# EasyEDA Pro project DRV8701E双电机驱动（逐飞布局）jzk.eprj

# Schematic DRV8701ERGER电机驱动双路
Board Name: DRV8701ERGER电机驱动双路（已验证）; Create Date: 2025-02-07; Page Name: P2; Project Name: DRV8701E双电机驱动（逐飞布局）; Schematic Name: DRV8701ERGER电机驱动双路; Update Date: 2025-02-07; Company: 嘉立创EDA; Drawed: 张志高; Page Size: B; Version: V1.0
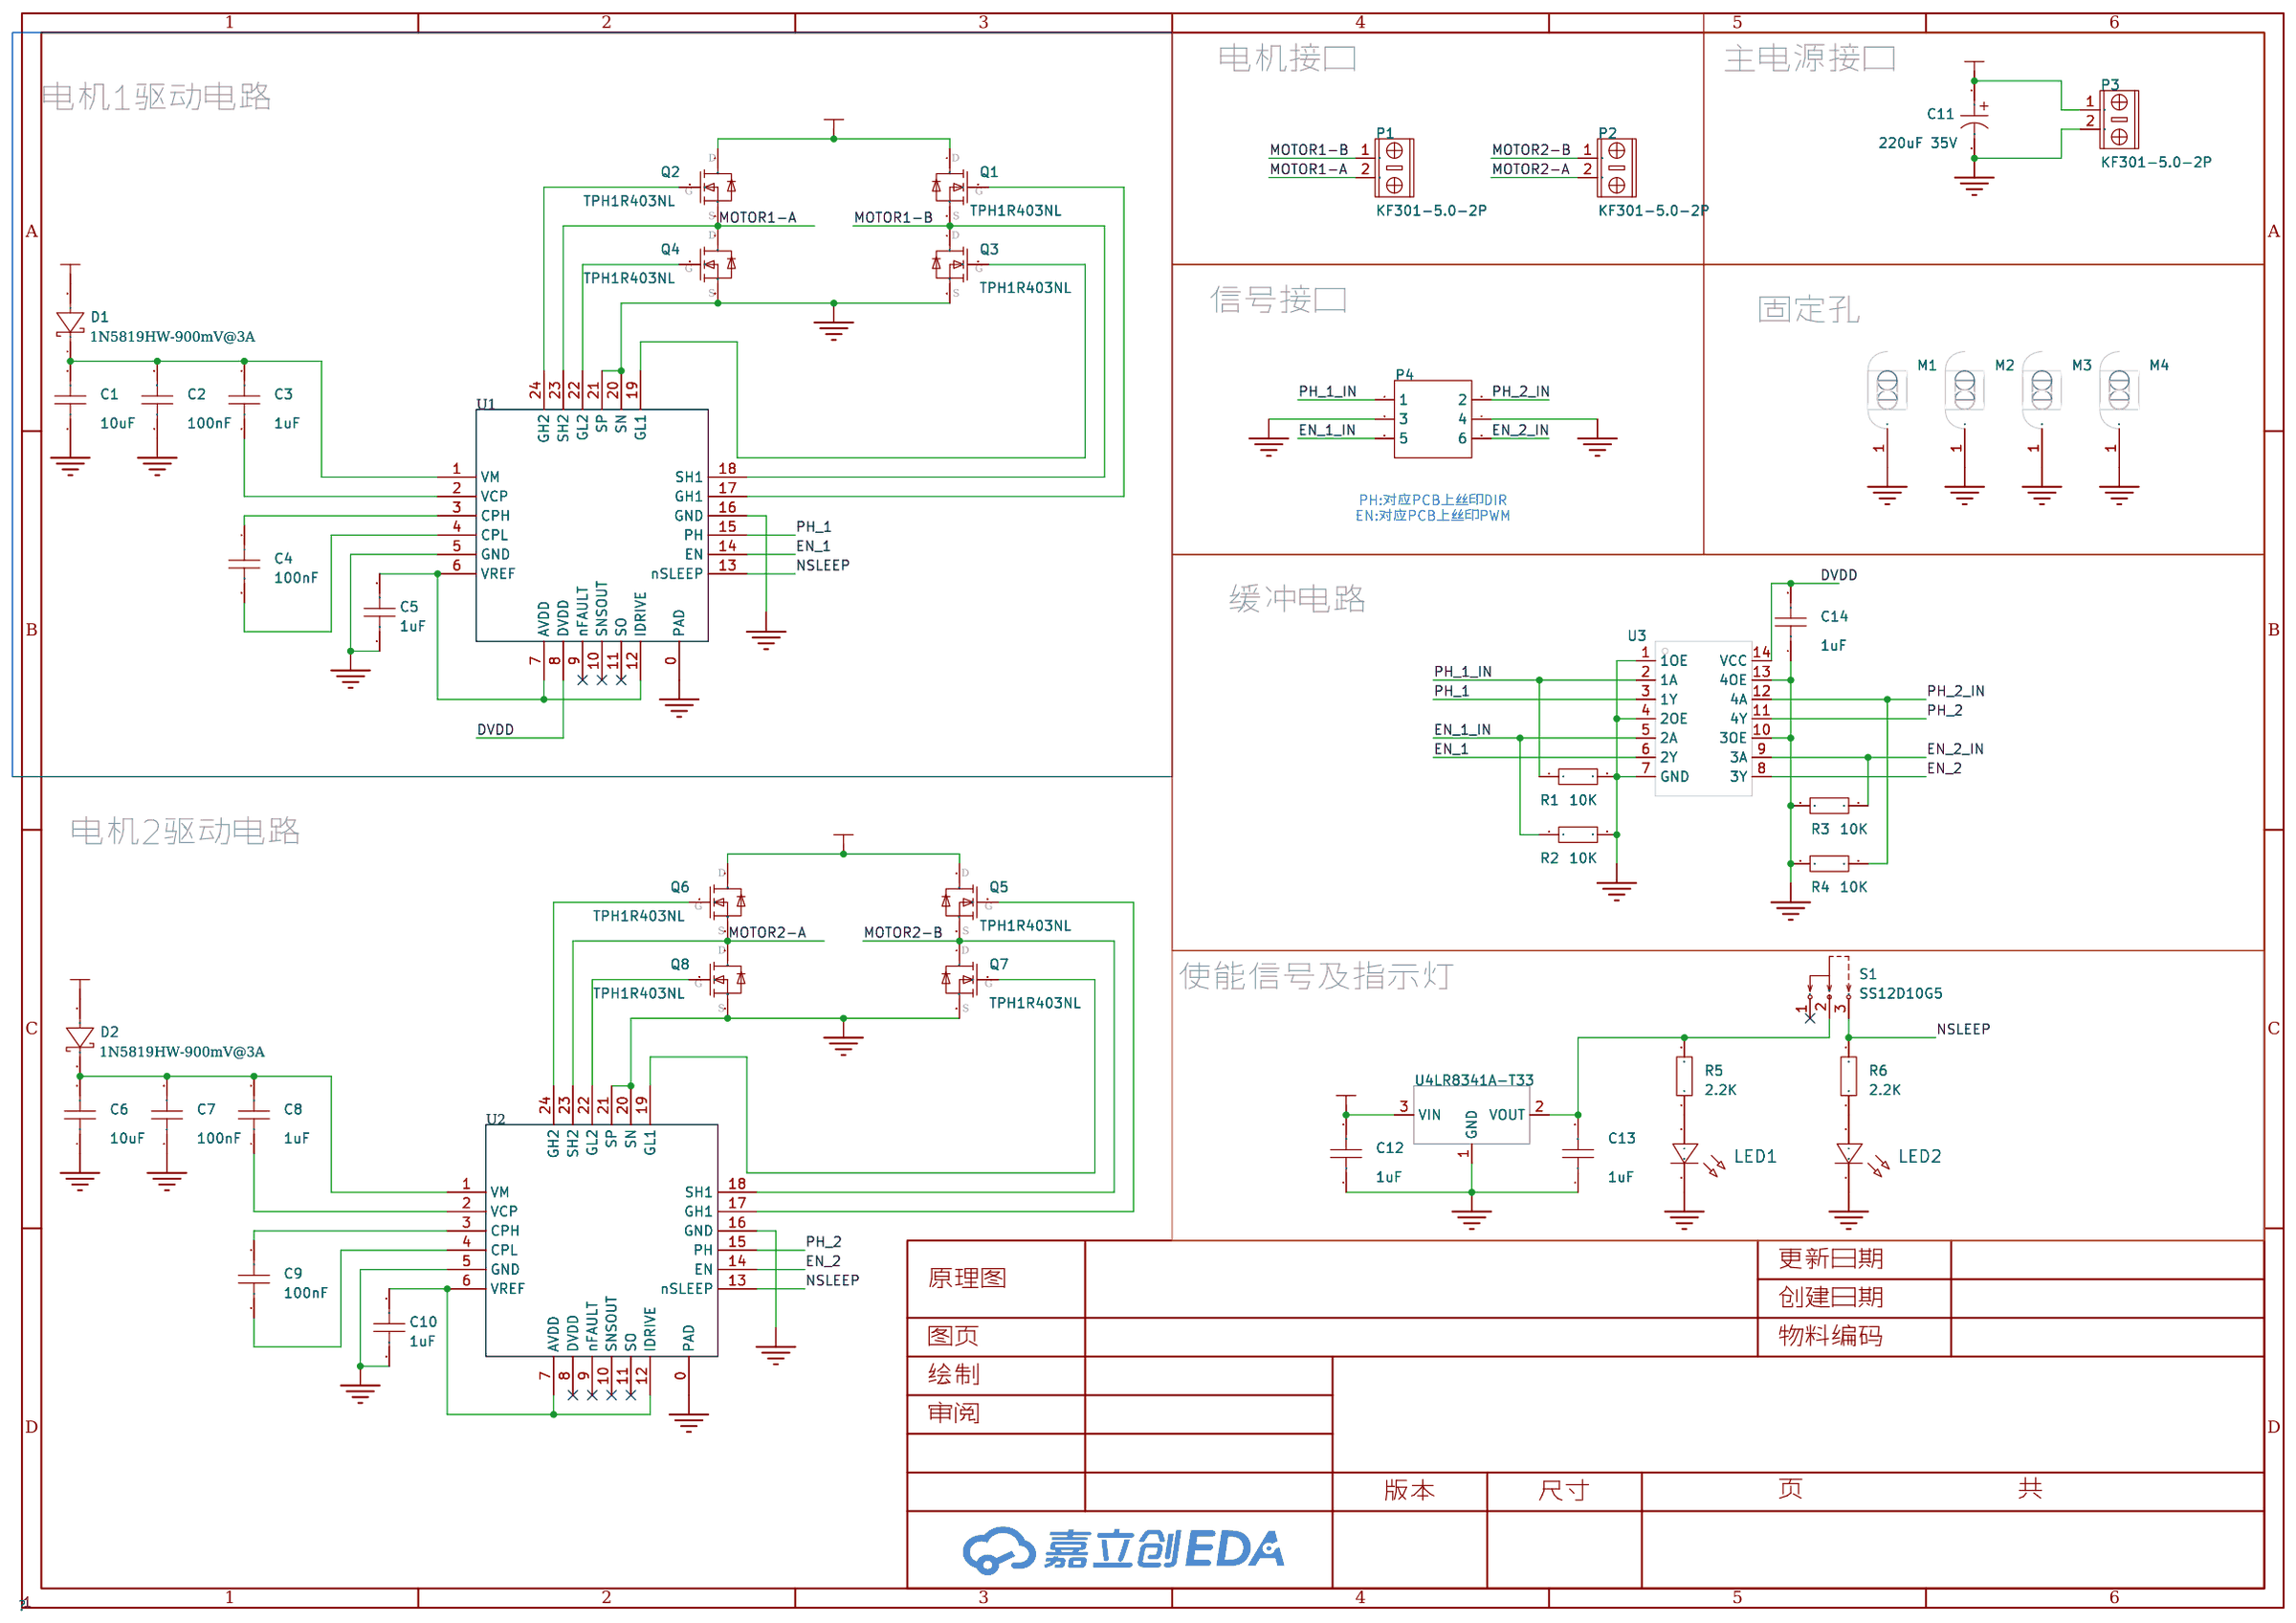
[diagram p0: schematic sheet]

## Parts
C1  10uF  [C0805]
C2  100nF  [C0603]
C3  1uF  [C0603]
C4  100nF  [C0603]
C5  1uF  [C0603]
C6  10uF  [C0805]
C7  100nF  [C0603]
C8  1uF  [C0603]
C9  100nF  [C0603]
C10  1uF  [C0603]
C11  220uF 35V  [CAP-TH_BD8.0-P3.50-D0.6-FD-2]
C12  1uF  [C0603]
C13  1uF  [C0603]
C14  1uF  [C0603]
D1  1N5819HW-900mV@3A  [SOD-123_L2.7-W1.6-LS3.7-RD-1]
D2  1N5819HW-900mV@3A  [SOD-123_L2.7-W1.6-LS3.7-RD-1]
LED1  -  [LED_0805]
LED2  -  [LED_0805]
M1  -  [长圆形固定孔L5.0-O3.0]
M2  -  [长圆形固定孔L5.0-O3.0]
M3  -  [长圆形固定孔L5.0-O3.0]
M4  -  [长圆形固定孔L5.0-O3.0]
P1  KF301-5.0-2P  [CONN-TH_P5.00_KF301-5.0-2P]
P2  KF301-5.0-2P  [CONN-TH_P5.00_KF301-5.0-2P]
P3  KF301-5.0-2P  [CONN-TH_P5.00_KF301-5.0-2P]
P4  -  [HDR-TH_6P-P2.54-V-F-R2-C3-S2.54]
Q1  TPH1R403NL  [DFN5x6]
Q2  TPH1R403NL  [DFN5x6]
Q3  TPH1R403NL  [DFN5x6]
Q4  TPH1R403NL  [DFN5x6]
Q5  TPH1R403NL  [DFN5x6]
Q6  TPH1R403NL  [DFN5x6]
Q7  TPH1R403NL  [DFN5x6]
Q8  TPH1R403NL  [DFN5x6]
R1  10K  [R0603]
R2  10K  [R0603]
R3  10K  [R0603]
R4  10K  [R0603]
R5  2.2K  [R0603]
R6  2.2K  [R0603]
S1  SS12D10G5  [SW-TH_SHOU-HAN_SS12D10G4]
U1  -  [VQFN-24_L4.0-W4.0-P0.50-TL-EP2.8]
U2  -  [VQFN-24_L4.0-W4.0-P0.50-TL-EP2.8]
U3  SN74HC125PWR  [TSSOP-14_L5.0-W4.4-P0.65-LS6.5-BL]
U4  LR8341A-T33  [SOT-23-3L_L2.9-W1.6-P1.90-LS2.8-BL]

## Library data of the parts
C1 C6 = CAP_0805: Supplier Footprint: 0805
C2-C5 C7-C10 C12-C14 = CAP_0603: Supplier Footprint: 0603
C11 = KNH2220UF35V149EC0049: 容值:220uF;精度:±20%;额定电压:35V;纹波电流:1.7A@100kHz;等效串联电阻:40mΩ@100kHz;; LCSC Part Name: 220uF ±20% 35V; Supplier Part: C2981462; Manufacturer: KNSCHA(科尼盛); Supplier Footprint: 插件,D8xL9mm; JLCPCB Part Class: 扩展库; Datasheet: https://atta.szlcsc.com/upload/public/pdf/source/20220426/9FC8A158D93B909CC105160B4A0CB698.pdf; Supplier: LCSC; Tolerance: ±20%; Rated Voltage: 35V; Ripple Current: 1.7A@100kHz; Equivalent Series Resistance(ESR): 40mΩ@100kHz; Lead Spacing: 3.5mm; φD: 8mm; L: 9mm; Lifetime @ Temp: 2000hrs@105℃; Operating Temperature: -55℃~+105℃
D1 D2 = 1N5819W: 二极管配置:-;正向压降(Vf):900mV@3A;直流反向耐压(Vr):40V;平均整流电流(Io):1A;; LCSC Part Name: 电压:40V 电流:1A; Supplier Part: C2905650; Manufacturer: TECH PUBLIC(台舟); Supplier Footprint: SOD-123; JLCPCB Part Class: 扩展库; Datasheet: https://atta.szlcsc.com/upload/public/pdf/source/20211020/7FEA34DA99E5285CBA3CC87767B82BE7.pdf; Supplier: LCSC; Forward Voltage (Vf@If): 900mV@3A; Reverse Voltage (Vr): 40V; Average Rectified Current (Io): 1A; Reverse Leakage Current (Ir): 1mA@40V
LED1 LED2 = LED_0805-R: Supplier Footprint: 0805
M1-M4 = 长圆形固定孔L5.0-O3.0
P1-P3 = KF301-5.0-2P: 结构:1x2P;间距:5mm;颜色:蓝色;安装方式:直插;额定电流:17A;额定电压:250V;排数:1;线规 - AWG:14~22;线规 - 平方毫米:1.5;每排PIN数:2;工作温度范围:-30℃~+120℃;; Supplier: LCSC; Supplier Part: C474881; Manufacturer: KEFA(科发); JLCPCB Part Class: 扩展库; LCSC Part Name: 5mm 1x2P 排数:1 每排P数:2 直插; Supplier Footprint: 插件,P=5mm; Datasheet: https://atta.szlcsc.com/upload/public/pdf/source/20230317/03A5B5FC229D6F9225E8F51DA1A4E80A.pdf; Structure: 1x2P; Pitch: 5mm; Color: 蓝色; Mounting Style: 直插; Current Rating (Max): 17A; Voltage Rating (Max): 250V; Number of Pins: 2P; Number of Rows: 1; Wire Gauge - AWG: 14~22; Wire Gauge - mm2: 1.5; Number of PINs Per Row: 2; Operating Temperature Range: -30℃~+120℃
P4 = HDR-F_2.54_2x3: Supplier Part: C92272; Supplier Footprint: 插件
Q1-Q8 = TPH1R403NL
R1-R6 = Res_0603: Supplier Footprint: 0603
S1 = SS12D10G5: 电路结构:单刀双掷;安装方式:直插;额定电流(DC):2A;额定电压(DC):125V;机械寿命:3千次;; LCSC Part Name: 两档立式插件 3脚拨动开关 柄长5.0mm; Supplier Part: C7431054; Manufacturer: SHOU HAN(首韩); Supplier Footprint: 插件; JLCPCB Part Class: 扩展库; Datasheet: https://atta.szlcsc.com/upload/public/pdf/source/20231130/7A3DB6A149BF0A1DCFFE64FFC07FE434.pdf; Supplier: LCSC; Circuit: 单刀双掷; Switch Length: 12.7mm; Switch Width: 6.7mm; Mounting Style: 直插; Current Rating (DC): 2A; Voltage Rating (DC): 125V; Mechanical Life: 3千次; Operating Temperature: -25℃~+70℃
U1 U2 = DRV8701ERGER: SymbolVersion: 2015-02-10; SymbolCreator: Altium; Alternate PartNumber: DRV8701ERGET; PackageReference: RGE0024F; MountType: SMT; ComponentLink1Description: Datasheet Link; ComponentLink1URL: https://sps06.itg.ti.com/sites/KMS/crossdivteams/altium/docs/ComponentDatasheets/DRV8701_011615.pdf; CompType: IC; Publisher: Texas Instruments; LatestRevisionDate: 2015-02-10; U/M: EA; Manufacturer: Texas Instruments; Alternate Manufacturer: Texas Instruments
U3 = SN74HC125PWR: Supplier Part: C132994; Manufacturer: TI(德州仪器); Supplier Footprint: TSSOP-14; JLCPCB Part Class: 扩展库; Datasheet: https://www.ti.com/cn/lit/gpn/sn74hc125; Supplier: LCSC; output type: 三态; Supply Voltage: 2V~6V; Number of Elements: 4; Number of Bits per Element: 1; Sink Current: 7.8mA; Source Current: 7.8mA; Logic Family: 74HC; Operating Temperature: -40℃~+85℃
U4 = LR8341A-T33: 输出类型:固定;最大输入电压:40V;输出电压:3.3V;最大输出电流:100mA;电源纹波抑制比(PSRR):55dB@(1kHz);输出极性:正极;; LCSC Part Name: 输入40V 输出3.3V 100mA; Supplier Part: C2829465; Manufacturer: LR(朗瑞); Supplier Footprint: SOT-23-3L; JLCPCB Part Class: 扩展库; Datasheet: https://atta.szlcsc.com/upload/public/pdf/source/20210426/C2829465_61F15D7ACE9671B48D4F69A8092B0D8F.pdf; Supplier: LCSC; Output Type: 固定; Maximum Input Voltage: 40V; Output Voltage: 3.3V; MAX Output Current: 100mA; Power Supply Rejection Ratio (PSRR): 55dB@(1kHz); standby current: 2uA; Operating Temperature: -40℃~+85℃; Output Polarity: 正极; Number of Outputs: 1

## Nets
DVDD: C14.2 U1.8(DVDD) U3.14(VCC)
GND: C1.1 C2.1 C5.1 C6.1 C7.1 C10.1 C11.2 C12.1 C13.1 C14.1 LED1.1(C) LED2.1(C) M1.1 M2.1 M3.1 M4.1 P3.2 P4.3 P4.4 Q3.3(S) Q4.3(S) Q7.3(S) Q8.3(S) R1.2 R2.2 R3.2 R4.2 U1.0(PAD) U1.5(GND) U1.16(GND) U1.20(SN) U1.21(SP) U2.0(PAD) U2.5(GND) U2.16(GND) U2.20(SN) U2.21(SP) U3.1(1OE) U3.4(2OE) U3.7(GND) U3.10(3OE) U3.13(4OE) U4.1(GND)
VIN: C11.1 C12.2 D1.2(A) D2.2(A) P3.1 Q1.1(D) Q2.1(D) Q5.1(D) Q6.1(D) U4.3(VIN)
EN_1: U1.14(EN) U3.6(2Y)
EN_1_IN: P4.5 R2.1 U3.5(2A)
EN_2: U2.14(EN) U3.8(3Y)
EN_2_IN: P4.6 R3.1 U3.9(3A)
MOTOR1-A: P1.2 Q2.3(S) Q4.1(D) U1.23(SH2)
MOTOR1-B: P1.1 Q1.3(S) Q3.1(D) U1.18(SH1)
MOTOR2-A: P2.2 Q6.3(S) Q8.1(D) U2.23(SH2)
MOTOR2-B: P2.1 Q5.3(S) Q7.1(D) U2.18(SH1)
NSLEEP: R6.1 S1.3 U1.13(nSLEEP) U2.13(nSLEEP)
PH_1: U1.15(PH) U3.3(1Y)
PH_1_IN: P4.1 R1.1 U3.2(1A)
PH_2: U2.15(PH) U3.11(4Y)
PH_2_IN: P4.2 R4.1 U3.12(4A)
$2N1900: LED2.2(A) R6.2
$2N1919: C1.2 C2.2 C3.2 D1.1(K) U1.1(VM)
$2N1920: C3.1 U1.2(VCP)
$2N1924: C4.1 U1.3(CPH)
$2N1925: C4.2 U1.4(CPL)
$2N1929: C5.2 U1.6(VREF) U1.7(AVDD) U1.12(IDRIVE)
$2N1938: Q2.2(G) U1.24(GH2)
$2N1940: Q3.2(G) U1.19(GL1)
$2N1941: Q1.2(G) U1.17(GH1)
$2N1947: Q4.2(G) U1.22(GL2)
$2N1948: C6.2 C7.2 C8.2 D2.1(K) U2.1(VM)
$2N1949: C8.1 U2.2(VCP)
$2N1953: C9.1 U2.3(CPH)
$2N1954: C9.2 U2.4(CPL)
$2N1956: C10.2 U2.6(VREF) U2.7(AVDD) U2.12(IDRIVE)
$2N1965: Q6.2(G) U2.24(GH2)
$2N1967: Q7.2(G) U2.19(GL1)
$2N1973: Q8.2(G) U2.22(GL2)
$2N1974: Q5.2(G) U2.17(GH1)
$2N1981: LED1.2(A) R5.1
$2N1983: C13.2 R5.2 S1.2 U4.2(VOUT)

Not connected (* = marked no-connect by the designer): S1 1*; U1 9(nFAULT)* 10(SNSOUT)* 11(SO)*; U2 8(DVDD)* 9(nFAULT)* 10(SNSOUT)* 11(SO)*

## Notes on the sheet
- 电机接口
- 主电源接口
- 电机1驱动电路
- 信号接口
- 固定孔
- PH:对应PCB上丝印DIR
  EN:对应PCB上丝印PWM
- 缓冲电路
- 电机2驱动电路
- 使能信号及指示灯

# Board DRV8701ERGER电机驱动双路
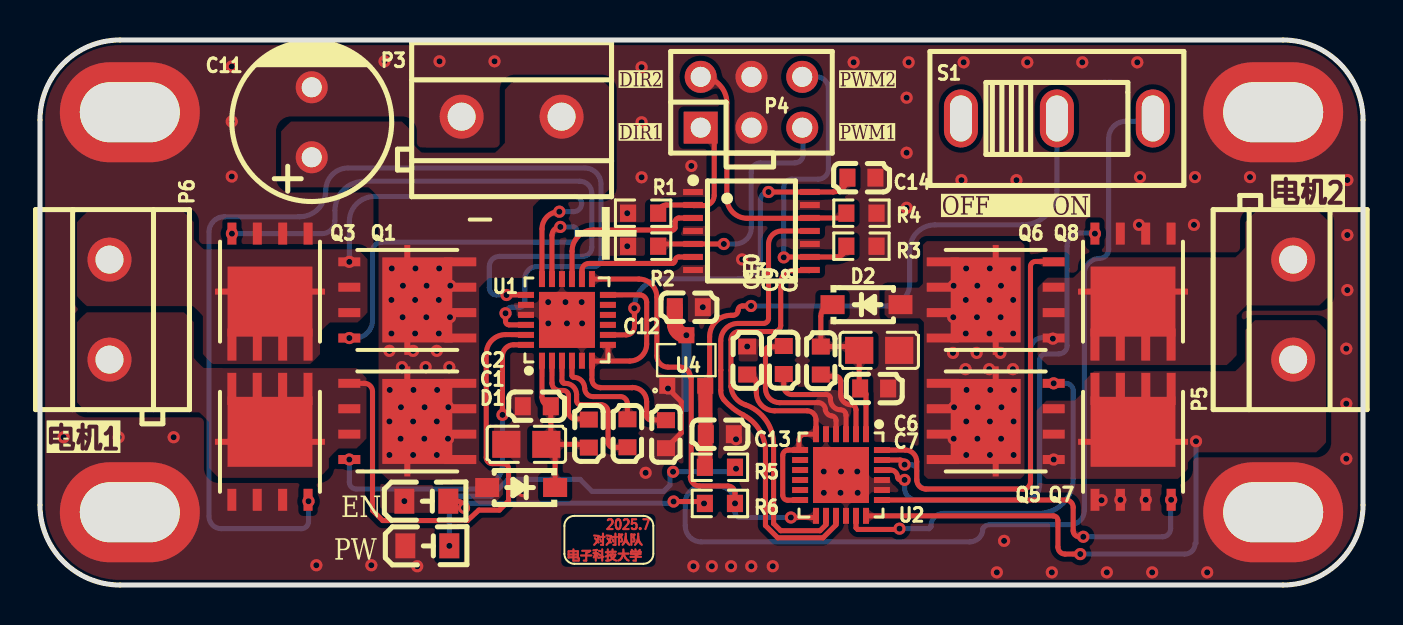
[diagram p1: board, top side]
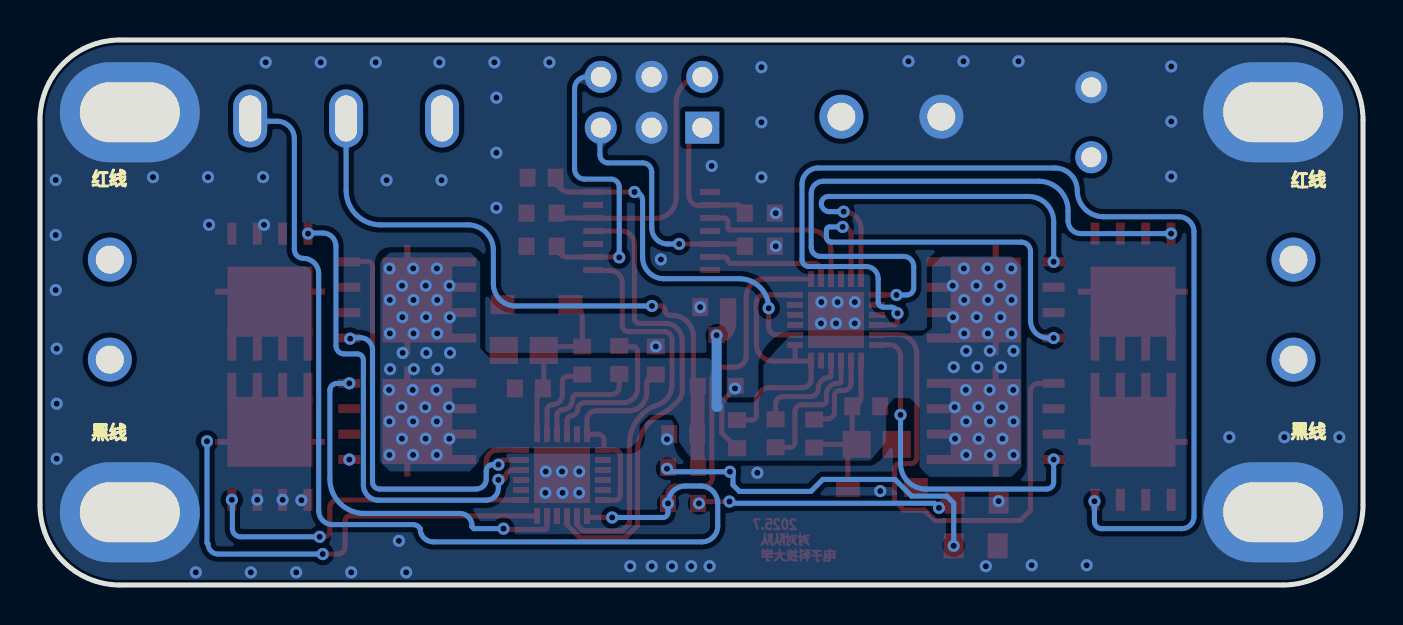
[diagram p2: board, bottom side, seen from below]

Outline 66.19 x 27.25 mm; copper layers: Top Layer, Bottom Layer. Coordinates in mm from the lower left corner of the outline.
Outline path: 0,23.25 0,4 arc(1.17,1.17) 4,0 62.19,0 arc(65.02,1.17) 66.19,4 66.19,23.25 arc(65.02,26.08) 62.19,27.25 4,27.25 arc(1.17,26.08) 0,23.25
Stack: Top Layer 0.035mm / Dielectric1 1.51mm FR4 er 4.5 / Bottom Layer 0.035mm

## Design rules (mm)
template: 自定义配置
spacing copperThickness1oz (default): track to track 0.102, other pairs 0.152 to 0.152
spacing copperThickness2oz: track to track 0.203, other pairs 0.152 to 0.3
track width copperThickness1oz (default): min 0.127, default 0.254, max 2.54
track width copperThickness2oz: min 0.203, default 0.254, max 2.54
differential pair differentialPair (default): width min 0.127, default 0.254, max 2.54; gap min 0.152, default 0.152
via viaSize (default): diameter min 0.5, default 0.61, max 10; hole min 0.3, default 0.305, max 6.299

## Placement (name value [footprint] x y rotation side)
C1  10uF  [C0805]  24.33 7.03 0 top
C2  100nF  [C0603]  24.85 8.94 0 top
C3  1uF  [C0603]  27.46 7.57 270 top
C4  100nF  [C0603]  29.39 7.59 90 top
C5  1uF  [C0603]  31.32 7.54 90 top
C6  10uF  [C0805]  41.98 11.73 180 top
C7  100nF  [C0603]  41.73 9.83 180 top
C8  1uF  [C0603]  39.06 11.22 90 top
C9  100nF  [C0603]  37.21 11.25 90 top
C10  1uF  [C0603]  35.38 11.22 270 top
C11  220uF 35V  [CAP-TH_BD8.0-P3.50-D0.6-FD-2]  13.59 23.14 90 top
C12  1uF  [C0603]  32.46 13.89 180 top
C13  1uF  [C0603]  34.01 7.54 180 top
C14  1uF  [C0603]  41.1 20.37 180 top
D1  1N5819HW-900mV@3A  [SOD-123_L2.7-W1.6-LS3.7-RD-1]  24.07 4.87 180 top
D2  1N5819HW-900mV@3A  [SOD-123_L2.7-W1.6-LS3.7-RD-1]  41.35 14.02 0 top
LED1  -  [LED_0805]  19.43 1.95 0 top
LED2  -  [LED_0805]  19.38 4.19 0 top
M1  -  [长圆形固定孔L5.0-O3.0]  4.5 23.64 0 top
M2  -  [长圆形固定孔L5.0-O3.0]  61.69 23.64 0 top
M3  -  [长圆形固定孔L5.0-O3.0]  4.5 3.64 0 top
M4  -  [长圆形固定孔L5.0-O3.0]  61.69 3.64 0 top
P3  KF301-5.0-2P  [CONN-TH_P5.00_KF301-5.0-2P]  23.59 23.42 180 top
P4  DS1023-2*3SF11  [HDR-TH_6P-P2.54-V-F-R2-C3-S2.54]  35.59 24.14 0 top
P5  KF301-5.0-2P  [CONN-TH_P5.00_KF301-5.0-2P]  62.69 13.77 90 top
P6  KF301-5.0-2P  [CONN-TH_P5.00_KF301-5.0-2P]  3.48 13.77 270 top
Q1  TPH1R403NL  [DFN5x6]  18.38 14.25 270 top
Q2  TPH1R403NL  [DFN5x6]  18.38 8.18 270 top
Q3  TPH1R403NL  [DFN5x6]  11.51 14.67 180 top
Q4  TPH1R403NL  [DFN5x6]  11.5 7.16 0 top
Q5  TPH1R403NL  [DFN5x6]  47.81 8.18 90 top
Q6  TPH1R403NL  [DFN5x6]  47.81 14.25 90 top
Q7  TPH1R403NL  [DFN5x6]  54.69 7.16 0 top
Q8  TPH1R403NL  [DFN5x6]  54.68 14.67 180 top
R1  10K  [R0603]  30.17 18.59 180 top
R2  10K  [R0603]  30.17 16.94 180 top
R3  10K  [R0603]  41.1 16.94 0 top
R4  10K  [R0603]  41.1 18.59 0 top
R5  2.2K  [R0603]  34.02 5.89 180 top
R6  2.2K  [R0603]  34.02 4.08 180 top
S1  SS12D10G5  [SW-TH_SHOU-HAN_SS12D10G4]  50.88 23.33 0 top
U1  DRV8701ERGER  [VQFN-24_L4.0-W4.0-P0.50-TL-EP2.8]  26.36 13.26 90 top
U2  DRV8701ERGER  [VQFN-24_L4.0-W4.0-P0.50-TL-EP2.8]  40.07 5.5 270 top
U3  SN74HC125PWR  [TSSOP-14_L5.0-W4.4-P0.65-LS6.5-BL]  35.59 17.7 270 top
U4  LR8341A-T33  [SOT-23-3L_L2.9-W1.6-P1.90-LS2.8-BL]  32.33 11.22 0 top

## Footprints (pads in the part's own frame, mm; a bottom-side part is the same pattern mirrored in y, then rotated)
C0603
  rect 0.8x0.9 smd: 1(-0.7,0) 2(0.7,0)
C0805
  rect 1.41x1.35 smd: 1(-1,0) 2(1,0)
CAP-TH_BD8.0-P3.50-D0.6-FD-2
  round 1.6 hole 1: 1(-1.75,0) 2(1.75,0)
CONN-TH_P5.00_KF301-5.0-2P
  round 2.2 hole 1.4: 1(-2.5,0) 2(2.5,0)
DFN5x6
  rect 0.45x1.6 smd: 1(-1.905,2.65) 1(-0.635,2.65) 1(0.635,2.65) 1(1.905,2.65)
  rect 4.25x3.5 smd: 1(0,0.5)
  rect 5.5x0.3 smd: 1(0,0)
  rect 0.45x1.1 smd: 2(1.905,-2.9) 3(-1.905,-2.9) 3(-0.635,-2.9) 3(0.635,-2.9)
HDR-TH_6P-P2.54-V-F-R2-C3-S2.54
  rect 1.7x1.6 hole 1: 1(-2.54,-1.27)
  round 1.6 hole 1: 2(-2.54,1.27) 3(0,-1.27) 4(0,1.27) 5(2.54,-1.27) 6(2.54,1.27)
LED_0805
  rect 1x1.25 smd: 1(-1.15,0.005) 2(1.05,0.005)
R0603
  rect 0.806x0.864 smd: 1(-0.753,0) 2(0.753,0)
SOD-123_L2.7-W1.6-LS3.7-RD-1
  rect 1.2x0.95 smd: 1(-1.7,0) 2(1.7,0)
SOT-23-3L_L2.9-W1.6-P1.90-LS2.8-BL
  rect 0.8x0.8 smd: 1(-0.95,-1.265) 2(0.95,-1.265) 3(0.005,1.265)
SW-TH_SHOU-HAN_SS12D10G4
  oval 1.7x2.9 hole 1.1x2.3: 1(-4.8,0) 2(0,0) 3(4.8,0)
TSSOP-14_L5.0-W4.4-P0.65-LS6.5-BL
  rect 0.305x0.991 smd: 1(-1.95,-2.925) 2(-1.3,-2.925) 3(-0.65,-2.925) 4(0,-2.925) 5(0.65,-2.925) 6(1.3,-2.925) 7(1.95,-2.925) 8(1.95,2.925) 9(1.3,2.925) 10(0.65,2.925) 11(0,2.925) 12(-0.65,2.925) 13(-1.3,2.925) 14(-1.95,2.925)
VQFN-24_L4.0-W4.0-P0.50-TL-EP2.8
  rect 2.8x2.8 smd: 0(-0.001,-0.001)
  rect 0.8x0.3 smd: 1(-2.042,1.25) 2(-2.042,0.75) 3(-2.042,0.25) 4(-2.042,-0.25) 5(-2.042,-0.75) 6(-2.042,-1.25) 13(2.042,-1.25) 14(2.042,-0.75) 15(2.042,-0.25) 16(2.042,0.25) 17(2.042,0.75) 18(2.042,1.25)
  rect 0.3x0.8 smd: 7(-1.25,-2.048) 8(-0.75,-2.048) 9(-0.25,-2.048) 10(0.249,-2.048) 11(0.75,-2.048) 12(1.25,-2.048) 19(1.25,2.048) 20(0.75,2.048) 21(0.249,2.048) 22(-0.25,2.048) 23(-0.75,2.048) 24(-1.25,2.048)
长圆形固定孔L5.0-O3.0
  oval 7x5 hole 5x3: 1(0,0)

## Nets
As in the schematic, except:
MOTOR1-A: P6.2 Q2.3 Q4.1 U1.23
MOTOR1-B: P6.1 Q1.3 Q3.1 U1.18
MOTOR2-A: P5.2 Q6.3 Q8.1 U2.23
MOTOR2-B: P5.1 Q5.3 Q7.1 U2.18

Pads without a net: S1 1; U1 9 10 11; U2 8 9 10 11

## Via types
v1: diameter 0.61, hole 0.305, Top Layer to Bottom Layer, 181 vias

## Routing (per net, layer and track width the routed paths; a pad name or vN(x,y) marks a point on that pad's centre or on a via; arc(x,y) is an arc through that point)
DVDD: length 18.1
  Top Layer w0.254: v1(36.45,19.65) U3.14 39.68,19.65 arc(40.19,19.86) 40.4,20.37 ; U1.8 29.32,12.51 arc(29.62,12.63) 29.74,12.93 29.74,13.83 arc(29.74,13.84) v1(29.73,13.84)
  Bottom Layer w0.254: v1(29.73,13.84) arc(30.16,14.88) 31.21,15.31 34.97,15.31 arc(35.73,15.63) 36.04,16.38 36.04,19.24 arc(36.16,19.53) v1(36.45,19.65)
GND: length 3.6
  Top Layer w0.254: v1(31.42,9.83) 32.08,9.17 32.08,7.6 C5.1
  vias: v1(1.18,7.39) v1(3.94,7.39) v1(6.69,7.39) v1(9.59,25.93) v1(9.59,23.17) v1(9.59,20.42) v1(13.82,0.99) v1(16.58,0.99) v1(17.24,26.18) v1(18.23,4.19) v1(18.87,0.94) v1(19.99,26.18) v1(22.74,26.18) v1(24.15,4.7) v1(25.42,14.14) v1(25.43,13.08) v1(26.29,14.14) v1(26.36,13.08) v1(27.1,14.14) v1(27.12,13.08) v1(29.38,18.59) v1(29.38,16.94) v1(30.1,25.89) v1(30.1,23.14) v1(30.1,20.39) v1(30.3,5.61) v1(32.59,20.95) v1(32.69,0.94) v1(33.16,13.89) v1(33.61,0.94) v1(34.57,0.94) v1(34.82,7.29) v1(35.13,16.28) v1(35.38,11.92) v1(35.59,0.94) v1(36.66,0.94) v1(39.21,5.67) v1(39.22,4.61) v1(40.07,5.67) v1(40.05,4.61) v1(40.71,26.13) v1(40.89,5.67) v1(40.91,4.61) v1(43.36,24.36) v1(43.36,21.61) v1(43.36,18.86) v1(43.46,26.13) v1(46.1,20.24) v1(46.21,26.13) v1(47.87,0.63) v1(48.23,2.21) v1(48.85,20.24) v1(49.39,26.13) v1(50.62,0.63) v1(52.15,26.13) v1(53.11,4.24) v1(53.37,0.63) v1(54.05,4.26) v1(54.9,26.13) v1(55.03,20.39) v1(54.98,18.01) v1(55.32,4.26) v1(55.64,0.63) v1(57.73,18.01) v1(57.78,20.39) v1(58.39,0.63) v1(60.54,20.39) v1(65.4,20.25) v1(65.4,17.5) v1(65.4,14.75) v1(65.35,11.82) v1(65.35,9.06) v1(65.35,6.31)
VIN: length 5.4
  Top Layer w0.8: 31.76,13.89 31.76,13.07 arc(31.93,12.66) v1(32.34,12.49)
  Bottom Layer w0.5: 32.28,8.91 32.34,8.91 v1(32.34,12.49)
  vias: v1(17.48,11.71) v1(17.5,9.75) v1(17.48,8.18) v1(17.48,6.5) v1(17.6,15.83) v1(17.58,14.25) v1(17.58,12.58) v1(18.04,7.31) v1(18.14,13.39) v1(18.11,10.89) v1(18.06,8.89) v1(18.16,14.96) v1(18.67,11.71) v1(18.68,9.75) v1(18.67,8.18) v1(18.67,6.5) v1(18.78,15.83) v1(18.77,14.25) v1(18.77,12.58) v1(19.24,8.89) v1(19.23,7.31) v1(19.34,14.96) v1(19.33,13.39) v1(19.29,10.89) v1(19.85,11.71) v1(19.87,9.75) v1(19.85,8.18) v1(19.85,6.5) v1(19.97,15.83) v1(19.95,14.25) v1(19.95,12.58) v1(20.43,8.89) v1(20.41,7.31) v1(20.53,14.96) v1(20.51,13.39) v1(20.48,10.89) v1(45.71,14.96) v1(45.69,13.39) v1(45.68,11.61) v1(45.73,8.89) v1(45.71,7.31) v1(46.33,15.83) v1(46.32,14.25) v1(46.32,12.58) v1(46.3,10.79) v1(46.34,8.18) v1(46.34,6.5) v1(46.36,9.75) v1(46.89,14.96) v1(46.88,13.39) v1(46.86,11.61) v1(46.91,8.89) v1(46.9,7.31) v1(47.52,15.83) v1(47.5,14.25) v1(47.5,12.58) v1(47.49,10.79) v1(47.54,9.75) v1(47.52,8.18) v1(47.52,6.5) v1(48.08,14.96) v1(48.06,13.39) v1(48.05,11.61) v1(48.1,8.89) v1(48.08,7.31) v1(48.7,15.83) v1(48.69,14.25) v1(48.69,12.58) v1(48.67,10.79) v1(48.73,9.75) v1(48.71,8.18) v1(48.71,6.5)
EN_1: length 6.4
  Top Layer w0.254: U1.14 27.11,15.73 arc(27.21,15.97) 27.46,16.08 31.62,16.08 arc(31.73,16.12) 31.77,16.23 arc(31.82,16.35) 31.95,16.4 U3.6
EN_1_IN: length 12.4
  Top Layer w0.254: v1(34.21,17.05) U3.5 31.04,17.05 arc(30.96,17.02) R2.1
  Bottom Layer w0.254: v1(34.21,17.05) 34.78,17.05 arc(35.35,17.29) 35.58,17.85 35.58,20.65 arc(35.72,20.97) 36.04,21.1 37.77,21.1 arc(38.06,21.22) 38.18,21.51 38.18,22.83 arc(38.16,22.86) P4.5
EN_2: length 20.3
  Top Layer w0.254: U2.14 39.32,3.01 39.03,2.72 37.06,2.72 36.7,3.07 36.7,7.03 arc(36.31,8.25) 35.28,9.01 arc(34.79,9.36) 34.57,9.93 arc(34.57,10.34) 34.57,10.74 34.57,12.27 arc(34.69,12.55) 34.97,12.67 36.75,12.67 arc(36.97,12.76) 37.06,12.98 37.06,15.11 arc(37.24,15.54) 37.67,15.72 38.49,15.72 arc(38.51,15.73) U3.8
EN_2_IN: length 15.4
  Top Layer w0.254: R3.1 arc(40.18,16.56) 39.8,16.4 U3.9 37.23,16.4 arc(37.22,16.39) v1(37.21,16.38)
  Bottom Layer w0.254: v1(37.21,16.38) 37.21,19.89 arc(37.33,20.17) 37.62,20.29 38.94,20.29 arc(39.3,20.44) 39.44,20.8 39.44,24.81 arc(39.27,25.23) 38.85,25.41 P4.6
MOTOR1-A: length 25.5
  Top Layer w0.254: Q2.3 16.23,10.08 arc(16.52,9.96) 16.64,9.67 16.64,3.73 17.14,3.22 21.39,3.22 21.96,3.75 22.98,3.75 23.44,4.2 23.44,5.81 arc(23.37,5.99) 23.19,6.07 22.63,6.07 arc(22.41,6.16) 22.33,6.37 22.33,11.55 arc(22.61,12.24) 23.29,12.52 24.3,12.52 arc(24.31,12.52) U1.23
MOTOR1-B: length 19.8
  Top Layer w0.254: U1.18 25.11,17.8 arc(25.37,18.41) v1(25.98,18.67)
  Bottom Layer w0.254: v1(25.98,18.67) 26.69,18.67 arc(26.98,18.79) 27.1,19.07 arc(27,19.32) 26.75,19.43 16.74,19.43 arc(15.85,19.06) 15.48,18.17 v1(15.48,16.16)
MOTOR2-A: length 16.7
  Top Layer w0.254: U2.23 43.02,6.25 arc(43.19,6.18) v1(43.25,6.02)
  Bottom Layer w0.254: v1(43.25,6.02) 43.56,6.02 arc(43.78,5.93) 43.86,5.71 43.86,5.31 arc(44.01,4.95) 44.37,4.8 49.2,4.8 arc(49.45,4.9) 49.55,5.15 49.55,11.76 arc(49.73,12.19) 50.16,12.37 50.62,12.37 arc(50.66,12.35) v1(50.67,12.32)
MOTOR2-B: length 23.6
  Top Layer w0.254: U2.18 50.69,3.46 arc(50.86,3.39) 50.93,3.22 50.93,1.9 arc(51.03,1.65) 51.28,1.55 v1(52.04,1.55)
  Bottom Layer w0.254: v1(52.04,1.55) 57.28,1.55 arc(57.64,1.7) 57.78,2.05 arc(57.82,2.07) 57.83,2.11 v1(57.83,7.19)
  vias: v1(50.71,6.27)
NSLEEP: length 69.9
  Top Layer w0.254: U1.13 29.96,15.3 arc(30.6,15.03) 30.86,14.4 30.86,11.45 arc(31.02,11.06) 31.42,10.89 32.03,10.89 arc(32.39,10.75) 32.54,10.39 32.58,10.34 32.58,5.45 32.54,5.41 arc(32.67,5.08) 32.99,4.95 34.42,4.95 arc(34.67,4.85) 34.77,4.59 v1(34.77,4.08) arc(34.77,4.08) 34.77,4.08 arc(34.77,4.08) R6.1 ; v1(37.57,3.38) 38.74,3.38 arc(38.8,3.4) U2.13
  Bottom Layer w0.254: v1(37.57,3.38) 35.03,3.38 arc(34.85,3.45) 34.77,3.63 v1(34.77,4.08) arc(34.52,4.7) 33.9,4.95 33.15,4.95 arc(32.54,4.7) 32.28,4.09 32.28,2.95 arc(32.52,2.39) 33.08,2.16 46.51,2.16 arc(46.87,2.26) 47.12,2.55 arc(47.16,2.68) 47.17,2.82 arc(47.32,2.97) 47.52,3.02 51.55,3.02 arc(52.04,3.22) 52.25,3.71 52.25,15.57 arc(52.47,16.11) 53.01,16.33 arc(53.33,16.46) 53.47,16.79 53.47,22.32 arc(53.72,22.93) 54.33,23.19 55.54,23.19 arc(55.63,23.23) S1.3
PH_1: length 8.5
  Top Layer w0.254: U3.3 31.97,18.35 arc(31.83,18.29) 31.77,18.16 31.77,17.85 arc(31.76,17.82) 31.72,17.8 arc(31.71,17.77) 31.67,17.75 27.69,17.75 arc(26.93,17.44) 26.62,16.69 26.62,15.3 arc(26.62,15.3) U1.15
PH_1_IN: length 7.1
  Top Layer w0.254: R1.1 arc(31.05,18.88) 31.34,19 U3.2 arc(32.68,18.98) 32.7,18.97 33.22,18.97 arc(33.58,19.12) 33.73,19.48 33.73,22.19 arc(33.53,22.67) P4.1
PH_2: length 23.9
  Top Layer w0.254: U3.11 37.11,17.7 arc(36.64,17.51) 36.45,17.04 36.45,13.33 arc(36.37,13.15) 36.19,13.08 34.92,13.08 arc(34.31,12.83) 34.06,12.21 34.06,10.74 arc(34.06,10.23) 34.06,9.73 arc(34.09,9.48) 34.21,9.27 arc(34.66,8.84) 35.18,8.51 arc(35.99,7.75) 36.3,6.68 36.3,2.97 36.91,2.36 39.17,2.36 39.83,3.01 U2.15
PH_2_IN: length 13.5
  Top Layer w0.254: P4.2 arc(33.98,25.02) 34.37,24.1 34.37,19.35 arc(34.66,18.63) 35.38,18.34 38.5,18.34 arc(38.52,18.34) U3.12 40.1,18.35 arc(40.27,18.42) R4.1
$2N1900: length 13.2
  Top Layer w0.254: LED2.2 20.88,4.19 arc(21.12,4.1) v1(21.21,3.86) ; v1(31.7,4.17) 33.13,4.17 arc(33.19,4.15) v1(33.22,4.08)
  Bottom Layer w0.254: v1(31.7,4.17) 31.61,4.09 21.44,4.09 v1(21.21,3.86)
$2N1919: length 9.2
  Top Layer w0.254: U1.1 25.11,9.38 arc(25.24,9.07) C2.2 25.56,7.26 arc(25.49,7.1) C1.2 ; D1.1 25.77,6.59 arc(25.64,6.9) C1.2 ; C1.2 27.29,7.03 arc(27.41,6.99) C3.2
$2N1920: length 4.4
  Top Layer w0.254: U1.2 25.61,10.09 arc(25.72,9.83) 25.98,9.73 26.19,9.73 arc(26.37,9.65) 26.44,9.47 26.44,8.66 arc(26.54,8.41) 26.8,8.3 27.43,8.3 arc(27.45,8.29) 27.46,8.27
$2N1924: length 7
  Top Layer w0.254: U1.3 26.11,10.2 arc(26.15,10.12) 26.24,10.08 26.29,10.08 arc(26.68,9.92) 26.85,9.52 26.85,9.22 arc(26.91,9.07) 27.05,9.01 28.07,9.01 arc(28.32,8.91) 28.42,8.66 28.42,7.13 arc(28.5,6.95) 28.68,6.88 29.38,6.88 arc(29.39,6.88) C4.1
$2N1925: length 5.1
  Top Layer w0.254: U1.4 26.61,10.47 arc(26.64,10.41) 26.69,10.39 arc(27.09,10.22) 27.25,9.83 arc(27.37,9.54) 27.66,9.42 29.03,9.42 arc(29.28,9.32) 29.39,9.06 29.39,8.29 arc(29.39,8.29) C4.2
$2N1929: length 14.4
  Top Layer w0.254: 28.42,11.2 27.63,11.2 arc(27.62,11.2) U1.6 27.61,10.28 arc(27.73,10) 28.01,9.88 28.03,9.86 29.63,9.86 29.64,9.88 arc(30.14,9.67) 30.35,9.17 30.35,8.46 arc(30.41,8.31) 30.56,8.25 31.31,8.25 arc(31.31,8.25) C5.2 ; 28.42,11.2 29.5,11.2 arc(30.1,11.45) 30.35,12.05 30.35,14.14 arc(30.25,14.4) 29.99,14.51 U1.12 ; 28.42,11.2 arc(28.41,11.2) 28.41,11.21 U1.7 arc(28.41,12.01) 28.42,12.01
$2N1938: length 16.6
  Top Layer w0.254: v1(23.14,8.51) 23.14,11.45 arc(23.3,11.85) 23.7,12.01 24.31,12.01 arc(24.31,12.01) U1.24
  Bottom Layer w0.254: v1(23.14,8.51) 23.14,6.07 arc(22.77,5.17) 21.87,4.8 15.82,4.8 arc(15.58,4.9) 15.48,5.14 v1(15.48,6.27)
$2N1940: length 31.6
  Top Layer w0.254: U1.19 23.35,14.51 arc(23.34,14.5) v1(23.34,14.5)
  Bottom Layer w0.254: v1(9.6,17.57) 14.12,17.57 arc(14.57,17.76) 14.76,18.21 14.76,18.72 arc(15.19,19.76) 16.23,20.19 27,20.19 arc(27.43,20.01) 27.61,19.58 27.61,16.89 arc(27.47,16.56) 27.15,16.43 22.99,16.43 arc(22.63,16.28) 22.48,15.92 22.48,14.86 arc(22.58,14.6) 22.83,14.5 v1(23.34,14.5)
$2N1941: length 20.2
  Top Layer w0.254: U1.17 25.61,17.48 arc(25.74,17.78) v1(26.03,17.9)
  Bottom Layer w0.254: v1(15.48,12.35) 15.75,12.35 arc(16.38,12.61) 16.64,13.23 16.64,16.69 arc(16.77,17.01) 17.09,17.14 26.59,17.14 arc(26.77,17.22) 26.85,17.4 26.85,17.75 arc(26.8,17.86) 26.69,17.9 v1(26.03,17.9) ; v1(26.03,17.9) arc(26.11,17.87) 26.14,17.8 ; v1(26.03,17.9) arc(26.06,17.98) 26.14,18.01
$2N1947: length 54.8
  Top Layer w0.254: U1.22 23.46,13.01 arc(23.34,13.06) 23.29,13.18 23.29,13.54 arc(23.26,13.56) v1(23.29,13.59)
  Bottom Layer w0.254: v1(13.44,4.19) 13.44,3.17 arc(13.33,2.92) 13.08,2.82 9.07,2.82 arc(8.64,3) 8.46,3.43 8.46,17.65 arc(8.68,18.19) 9.22,18.41 12.98,18.41 arc(13.91,18.8) 14.3,19.73 arc(14.63,20.52) 15.42,20.85 27.25,20.85 arc(27.83,20.61) 28.07,20.04 28.07,16.27 arc(27.96,16.03) 27.72,15.92 24.87,15.92 arc(24.43,15.74) 24.26,15.31 24.26,14.14 arc(24.18,13.97) 24,13.89 23.6,13.89 arc(23.38,13.8) v1(23.29,13.59)
$2N1948: length 8.8
  Top Layer w0.254: U2.1 41.32,9.53 arc(41.24,9.74) C7.2 arc(41,9.84) 40.98,9.87 C6.2 arc(40.93,11.87) 40.79,11.92 C8.2 39.06,13.43 arc(39.24,13.85) D2.1
$2N1949: length 4.3
  Top Layer w0.254: U2.2 40.82,8.75 arc(40.75,8.94) 40.56,9.01 arc(40.2,9.16) 40.05,9.52 40.05,10.18 arc(39.98,10.36) 39.8,10.44 39.15,10.44 arc(39.09,10.46) C8.1
$2N1953: length 5.5
  Top Layer w0.254: C9.1 37.21,9.93 arc(37.33,9.64) 37.62,9.52 39.34,9.52 arc(39.49,9.46) 39.55,9.32 39.55,9.27 arc(39.7,8.91) 40.05,8.76 arc(40.25,8.68) 40.32,8.49 U2.3
$2N1954: length 8
  Top Layer w0.254: U2.4 39.82,8.23 arc(39.76,8.39) 39.6,8.46 arc(39.39,8.56) 39.29,8.76 arc(39.19,9.01) 38.94,9.12 37.01,9.12 arc(36.5,9.32) 36.3,9.83 36.3,11.71 arc(36.35,11.85) 36.5,11.91 37.17,11.91 arc(37.2,11.92) C9.2
$2N1956: length 11.2
  Top Layer w0.254: U2.12 arc(38.02,4.24) 38.02,4.24 37.41,4.24 arc(37.23,4.31) 37.16,4.49 37.16,6.47 arc(37.24,6.67) 37.43,6.75 U2.7 arc(37.99,6.76) 37.97,6.8 37.97,7.24 arc(38.06,7.45) 38.28,7.54 U2.6 38.82,8.26 arc(38.69,8.58) 38.38,8.71 36.75,8.71 arc(36.11,8.98) 35.84,9.62 35.84,10.07 arc(35.7,10.39) C10.2
$2N1965: length 21.2
  Top Layer w0.254: U2.24 43.29,6.75 arc(43.69,6.58) 43.86,6.17 43.86,5.25 arc(44,4.93) 44.32,4.8 49.2,4.8 arc(49.45,4.9) 49.55,5.15 49.55,15.92 arc(49.63,16.1) 49.81,16.18 50.69,16.18 arc(50.71,16.17) Q6.2
$2N1967: length 17.7
  Top Layer w0.254: v1(52.2,2.41) 51.99,2.41 arc(51.78,2.5) 51.69,2.72 51.69,3.88 arc(51.58,4.14) 51.32,4.25 U2.19
  Bottom Layer w0.254: v1(52.2,2.41) 56.16,2.41 arc(56.45,2.53) 56.56,2.82 56.56,4.23 arc(56.57,4.25) v1(56.59,4.26)
$2N1973: length 24.2
  Top Layer w0.254: v1(43.25,5.25) 43.05,5.25 arc(42.94,5.3) 42.9,5.41 arc(42.8,5.65) 42.56,5.75 U2.22
  Bottom Layer w0.254: v1(43.25,5.25) 43.25,4.85 arc(43.43,4.42) 43.86,4.24 49.25,4.24 arc(49.79,4.46) 50.01,5 50.01,11.25 arc(50.1,11.46) 50.32,11.55 50.98,11.55 arc(51.26,11.67) 51.38,11.96 51.38,16.94 arc(51.58,17.41) 52.04,17.6 52.75,17.6 arc(52.77,17.59) v1(52.78,17.57)
$2N1974: length 18.5
  Top Layer w0.254: U2.17 40.82,2.86 40.91,2.78 42.96,2.78 v1(43,2.82)
  Bottom Layer w0.254: v1(43,2.82) 44.48,2.82 44.58,2.91 44.58,2.97 arc(44.75,3.4) 45.19,3.58 49.96,3.58 arc(51.18,4.08) 51.69,5.31 51.69,9.73 arc(51.58,9.98) 51.33,10.08 50.72,10.08 arc(50.71,10.08) v1(50.71,10.08)
$2N1981: length 18
  Bottom Layer w0.254: v1(20.48,1.96) 20.48,1.96 20.48,4.1 20.82,4.44 22.58,4.44 23.42,5.28 27.02,5.28 27.62,4.68 31.2,4.68 31.52,5 31.52,5.51 v1(31.67,5.66) 34.67,5.66 v1(34.82,5.81)
$2N1983: length 32.5
  Top Layer w0.254: v1(35.57,13.95) 35.14,13.95 arc(34.99,13.89) 34.92,13.74 arc(34.85,13.56) 34.67,13.48 34.57,13.48 arc(33.81,13.17) 33.5,12.42 33.5,10.18 arc(33.44,10.02) U4.2
  Top Layer w0.7: U4.2 arc(33.29,8.75) C13.2 arc(33.3,6.71) R5.2
  Bottom Layer w0.254: v1(35.57,13.95) 42.4,13.95 arc(43.18,14.28) 43.51,15.06 43.51,16.74 arc(43.88,17.63) 44.78,18.01 49.15,18.01 arc(50.37,18.51) 50.88,19.73 S1.2

## Copper pours and planes (outline as drawn; the poured copper is in the pictures)
GND on Top Layer: -1.5,28.88 68.15,28.88 68.15,-1.7 -1.5,-1.7
GND on Bottom Layer: -1.5,28.88 68.15,28.88 68.15,-1.7 -1.5,-1.7
VIN on Top Layer: 42.25,17.19 49.25,17.19 49.25,5.31 42.25,5.31
VIN on Top Layer: 12.06,25.26 28.59,25.26 28.59,4.02 12.06,4.02
VIN on Bottom Layer: 17.09,16.63 49.17,16.63 49.17,5.41 17.09,5.41
MOTOR1-A on Top Layer: 1.85,13.64 16.33,13.64 16.33,5.36 1.85,5.36
MOTOR1-B on Top Layer: 1.85,18.64 16.38,18.64 16.38,11.05 1.85,11.05
MOTOR2-A on Top Layer: 49.91,18.64 64.49,18.64 64.49,11 49.91,11
MOTOR2-B on Top Layer: 49.86,13.24 64.34,13.24 64.34,5.31 49.86,5.31

Small or netless copper shapes (teardrops, artwork), in the pictures only: 94 on Top Layer, 29 on Bottom Layer

## Text on the board
Bottom Silkscreen Layer: 红线 | 黑线
Top Layer: 2025.7 / 对对队队 / 电子科技大学
Top Solder Mask Layer: 2025.7 / 对对队队 / 电子科技大学
Top Silkscreen Layer: DIR2 | DIR1 | PWM2 | PWM1 | OFF         ON | 电机1 | 电机2 | PW | EN | — | +
